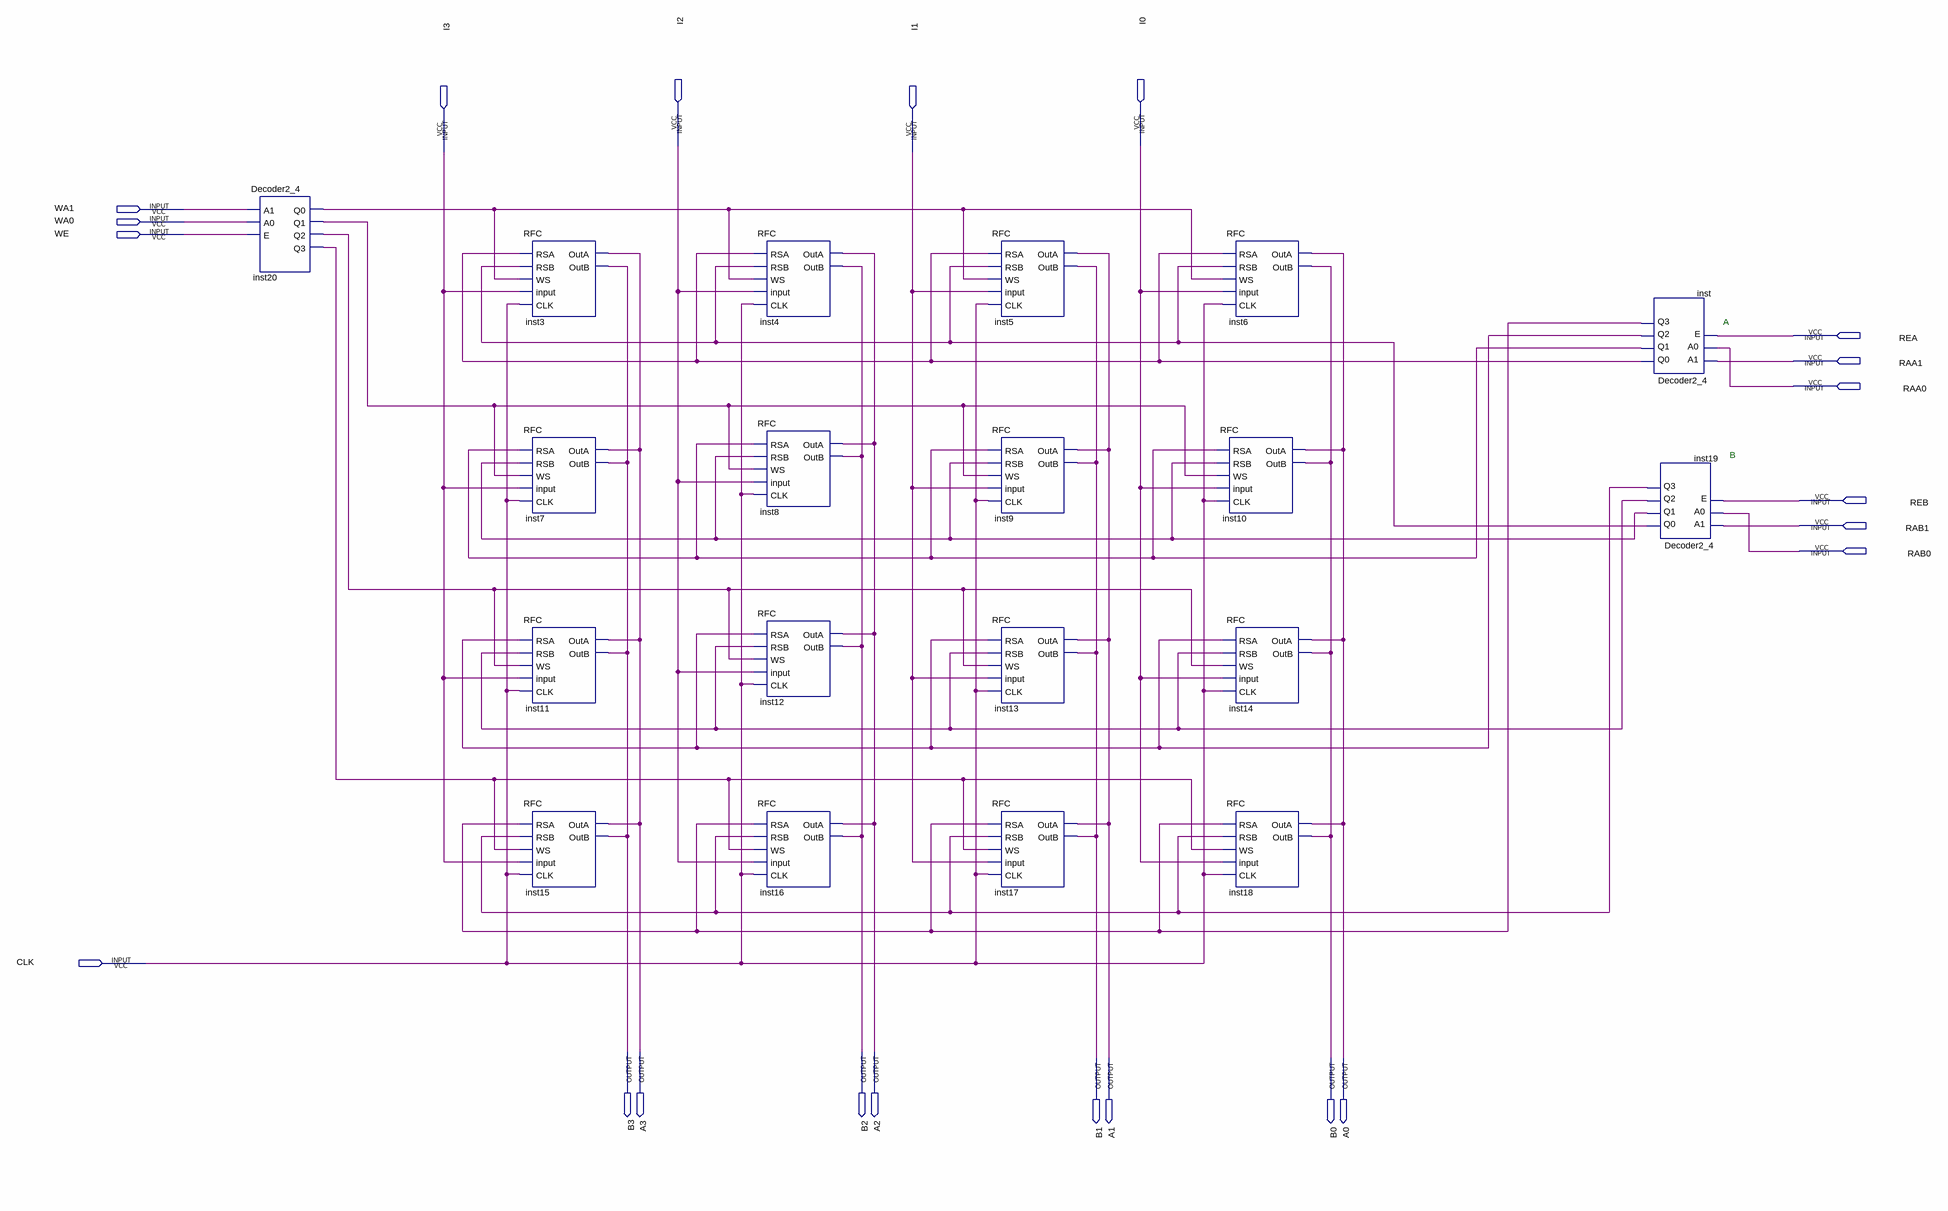
[diagram p0: schematic sheet]
// Quartus schematic register.bdf as structural Verilog: 19 symbols, 22 pins
module register (
  input  I2,
  input  I0,
  input  I3,
  input  I1,
  input  WA1,
  input  WA0,
  input  WE,
  input  REA,
  input  RAA1,
  input  RAA0,
  input  REB,
  input  RAB1,
  input  RAB0,
  input  CLK,
  output B3,
  output A3,
  output B2,
  output A2,
  output B1,
  output A1,
  output B0,
  output A0
);

  wire inst19_q0, inst19_q1, inst19_q2, inst19_q3, inst20_q0, inst20_q1, inst20_q2, inst20_q3, inst_q0,
       inst_q1, inst_q2, inst_q3;

  Decoder2_4 inst20 (.A1(WA1), .A0(WA0), .E(WE), .Q0(inst20_q0), .Q1(inst20_q1), .Q2(inst20_q2), .Q3(inst20_q3));
  RFC inst3 (.RSA(inst_q0), .RSB(inst19_q0), .WS(inst20_q0), .\input (I3), .CLK(CLK), .OutA(A3), .OutB(B3));
  RFC inst7 (.RSA(inst_q1), .RSB(inst19_q1), .WS(inst20_q1), .\input (I3), .CLK(CLK), .OutA(A3), .OutB(B3));
  RFC inst11 (.RSA(inst_q2), .RSB(inst19_q2), .WS(inst20_q2), .\input (I3), .CLK(CLK), .OutA(A3), .OutB(B3));
  RFC inst15 (.RSA(inst_q3), .RSB(inst19_q3), .WS(inst20_q3), .\input (I3), .CLK(CLK), .OutA(A3), .OutB(B3));
  RFC inst4 (.RSA(inst_q0), .RSB(inst19_q0), .WS(inst20_q0), .\input (I2), .CLK(CLK), .OutA(A2), .OutB(B2));
  RFC inst8 (.RSA(inst_q1), .RSB(inst19_q1), .WS(inst20_q1), .\input (I2), .CLK(CLK), .OutA(A2), .OutB(B2));
  RFC inst12 (.RSA(inst_q2), .RSB(inst19_q2), .WS(inst20_q2), .\input (I2), .CLK(CLK), .OutA(A2), .OutB(B2));
  RFC inst16 (.RSA(inst_q3), .RSB(inst19_q3), .WS(inst20_q3), .\input (I2), .CLK(CLK), .OutA(A2), .OutB(B2));
  RFC inst5 (.RSA(inst_q0), .RSB(inst19_q0), .WS(inst20_q0), .\input (I1), .CLK(CLK), .OutA(A1), .OutB(B1));
  RFC inst9 (.RSA(inst_q1), .RSB(inst19_q1), .WS(inst20_q1), .\input (I1), .CLK(CLK), .OutA(A1), .OutB(B1));
  RFC inst13 (.RSA(inst_q2), .RSB(inst19_q2), .WS(inst20_q2), .\input (I1), .CLK(CLK), .OutA(A1), .OutB(B1));
  RFC inst17 (.RSA(inst_q3), .RSB(inst19_q3), .WS(inst20_q3), .\input (I1), .CLK(CLK), .OutA(A1), .OutB(B1));
  RFC inst6 (.RSA(inst_q0), .RSB(inst19_q0), .WS(inst20_q0), .\input (I0), .CLK(CLK), .OutA(A0), .OutB(B0));
  RFC inst10 (.RSA(inst_q1), .RSB(inst19_q1), .WS(inst20_q1), .\input (I0), .CLK(CLK), .OutA(A0), .OutB(B0));
  RFC inst14 (.RSA(inst_q2), .RSB(inst19_q2), .WS(inst20_q2), .\input (I0), .CLK(CLK), .OutA(A0), .OutB(B0));
  RFC inst18 (.RSA(inst_q3), .RSB(inst19_q3), .WS(inst20_q3), .\input (I0), .CLK(CLK), .OutA(A0), .OutB(B0));
  Decoder2_4 inst (.A1(RAA1), .A0(RAA0), .E(REA), .Q0(inst_q0), .Q1(inst_q1), .Q2(inst_q2), .Q3(inst_q3));
  Decoder2_4 inst19 (.A1(RAB1), .A0(RAB0), .E(REB), .Q0(inst19_q0), .Q1(inst19_q1), .Q2(inst19_q2), .Q3(inst19_q3));

  // Notes on the sheet:
  //   A
  //   B
endmodule
